# EAGLE design main_board (EAGLE 9.5.1)
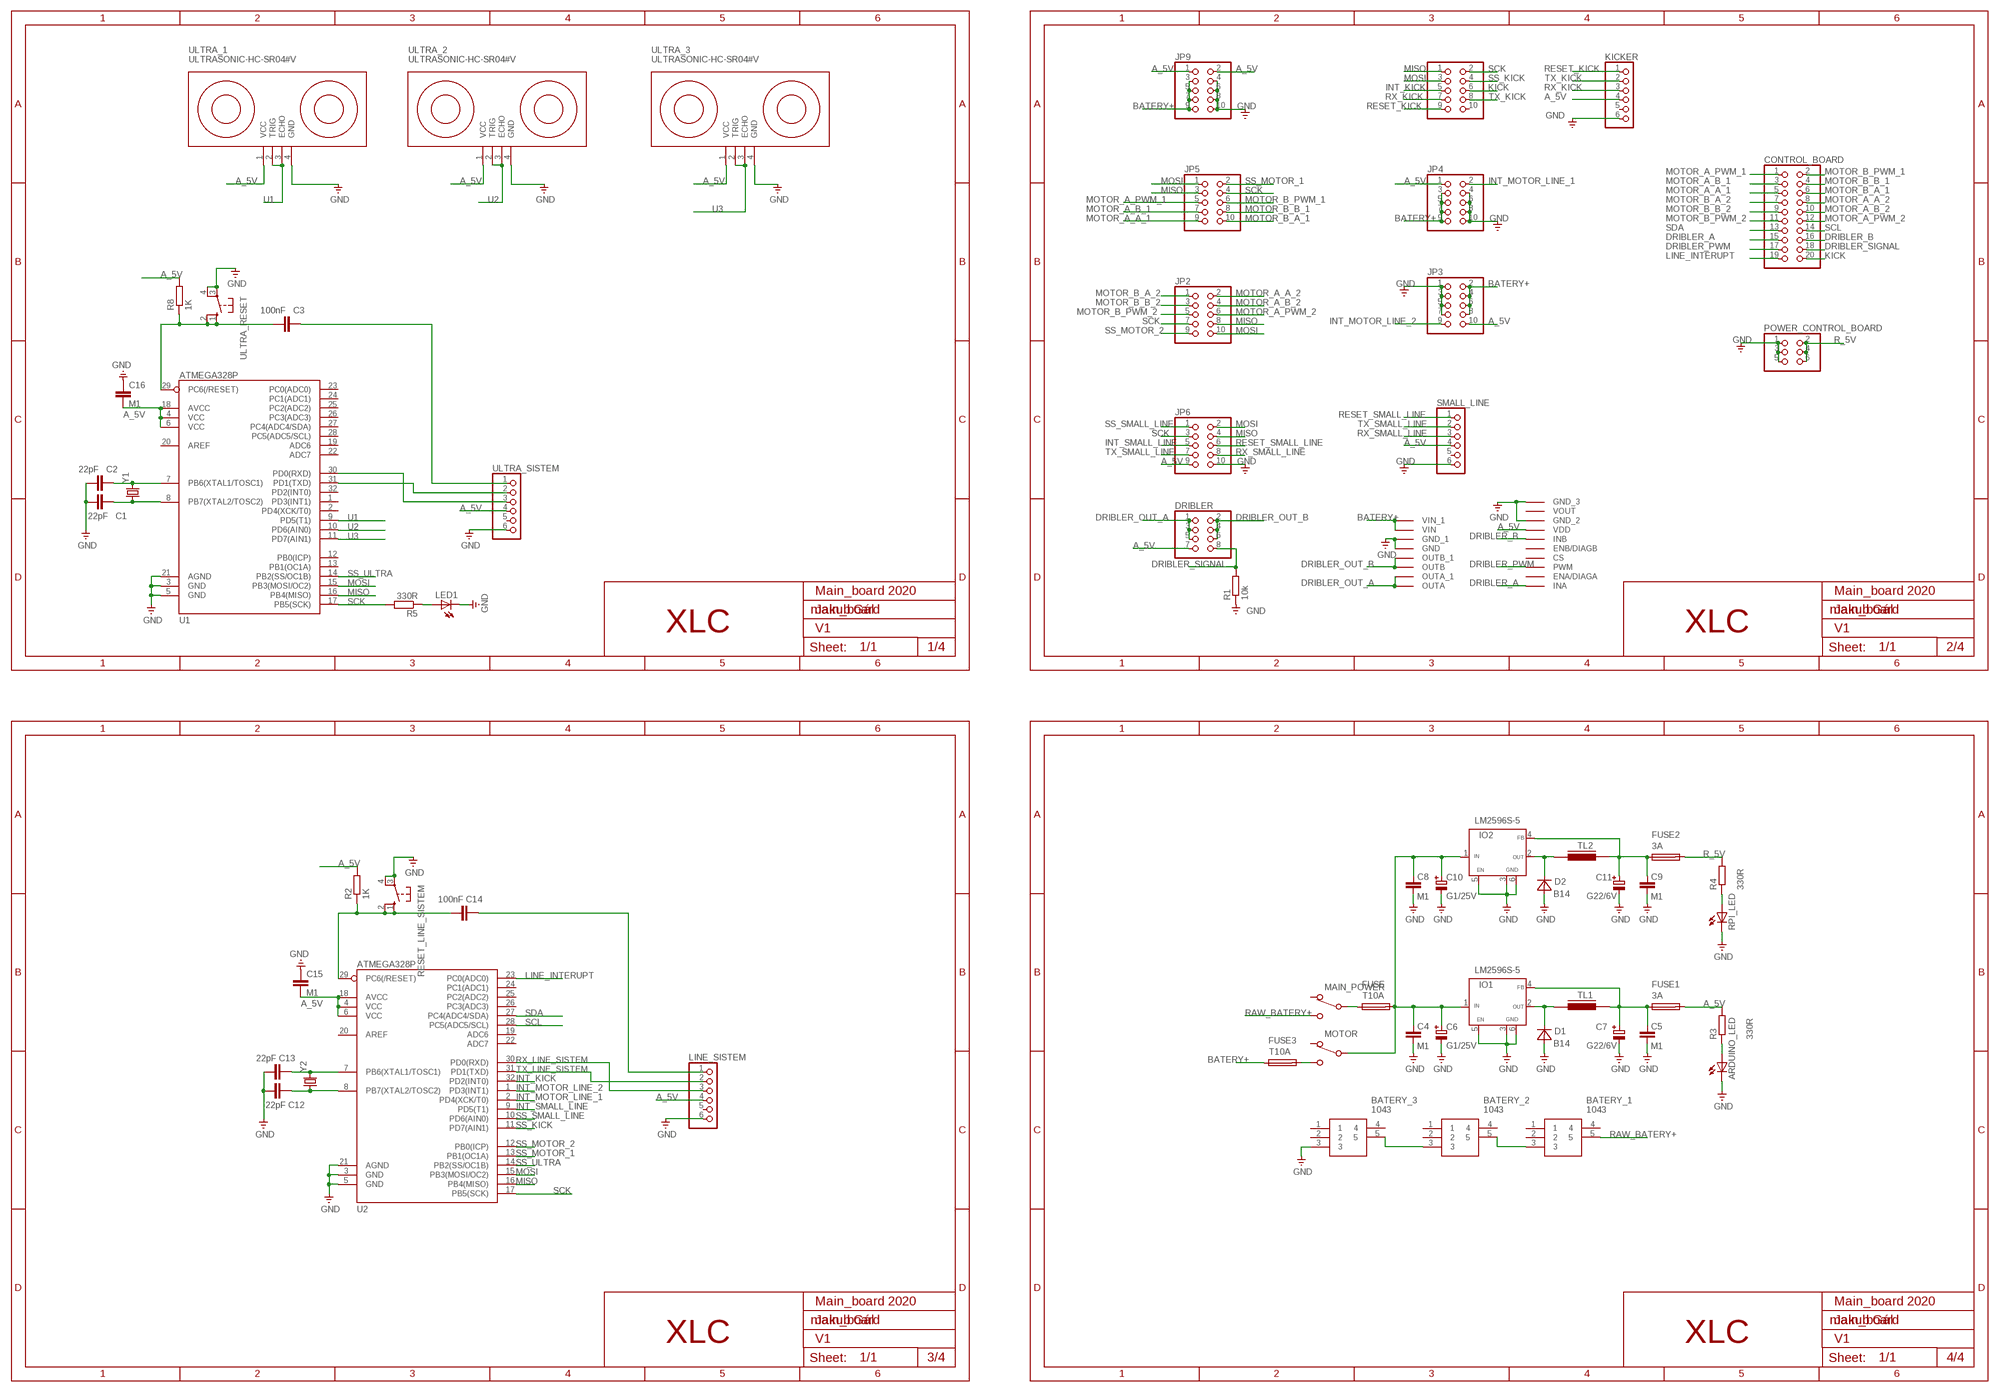
[diagram p0: schematic, sheet 1]

## Parts
ARDUINO_LED  LEDCHIPLED_0603  [CHIPLED_0603]
BATERY_1  1043  [1043]
BATERY_2  1043  [1043]
BATERY_3  1043  [1043]
C1  22pF  C-EUC0603  [C0603]
C2  22pF  C-EUC0603  [C0603]
C3  100nF  C-EUC0603  [C0603]
C4  M1  KOND-KERAM1206-SMD  [SMD-1206]
C5  M1  KOND-KERAM1206-SMD  [SMD-1206]
C6  G1/25V  KOND-ELEKTD-SMD  [SMD-ELE-D]
C7  G22/6V  KOND-ELEKTD-SMD  [SMD-ELE-D]
C8  M1  KOND-KERAM1206-SMD  [SMD-1206]
C9  M1  KOND-KERAM1206-SMD  [SMD-1206]
C10  G1/25V  KOND-ELEKTD-SMD  [SMD-ELE-D]
C11  G22/6V  KOND-ELEKTD-SMD  [SMD-ELE-D]
C12  22pF  C-EUC0603  [C0603]
C13  22pF  C-EUC0603  [C0603]
C14  100nF  C-EUC0603  [C0603]
C15  M1  C-EUC0603  [C0603]
C16  M1  C-EUC0603  [C0603]
CONTROL_BOARD  PINHD-2X10_2.54-SMD  [2X10SMD]
D1  B14  DIODASMD-3,6X5,5  [D-3,6X5,5]
D2  B14  DIODASMD-3,6X5,5  [D-3,6X5,5]
DRIBLER  PINHD-2X4_2.54-SMD  [2X04SMD]
FUSE  T10A  POISTKA2A  [SH22,5A]
FUSE1  3A  POISTKA2A  [SH22,5A]
FUSE2  3A  POISTKA2A  [SH22,5A]
FUSE3  T10A  POISTKA2A  [SH22,5A]
IO1  LM2596S-5  LM2596S  [TO263-5]
IO2  LM2596S-5  LM2596S  [TO263-5]
JP2  PINHD-2X5_2.54-SMD  [2X05SMD]
JP3  PINHD-2X5_2.54-SMD  [2X05SMD]
JP4  PINHD-2X5_2.54-SMD  [2X05SMD]
JP5  PINHD-2X5_2.54-SMD  [2X05SMD]
JP6  PINHD-2X5_2.54-SMD  [2X05SMD]
JP8  PINHD-2X5_2.54-SMD  [2X05SMD]
JP9  PINHD-2X5_2.54-SMD  [2X05SMD]
KICKER  PINHD-1X6  [1X06]
LED1  LEDCHIPLED_0603  [CHIPLED_0603]
LINE_SISTEM  PINHD-1X6  [1X06]
MAIN_POWER  PREP-1PB  [P-B069B]
MOTOR  PREP-1PB  [P-B069B]
POWER_CONTROL_BOARD  PINHD-2X3_2.54-SMD  [2X03SMD]
R1  10k  R-EU_R0603  [R0603]
R2  1K  R-EU_R0603  [R0603]
R3  330R  R-EU_R0603  [R0603]
R4  330R  R-EU_R0603  [R0603]
R5  330R  R-EU_R0603  [R0603]
R8  1K  R-EU_R0603  [R0603]
RESET_LINE_SISTEM  10-XX  [B3F-10XX]
RPI_LED  LEDCHIPLED_0603  [CHIPLED_0603]
SMALL_LINE  PINHD-1X6  [1X06]
TL1  INDUK-TLSMD1  [INDUK-TL]
TL2  INDUK-TLSMD1  [INDUK-TL]
U1  ATMEGA328P  ATMEGA328_SMT  [TQFP32-08]
U2  ATMEGA328P  ATMEGA328_SMT  [TQFP32-08]
U$4  MOTOR_DRIVER  [MOTOR_DRIVER]
ULTRA_1  ULTRASONIC-HC-SR04#V  [ULTRASONIC-HC-SR04#V]
ULTRA_2  ULTRASONIC-HC-SR04#V  [ULTRASONIC-HC-SR04#V]
ULTRA_3  ULTRASONIC-HC-SR04#V  [ULTRASONIC-HC-SR04#V]
ULTRA_RESET  10-XX  [B3F-10XX]
ULTRA_SISTEM  PINHD-1X6  [1X06]
Y1  CRYSTALHC49US  [HC49US]
Y2  CRYSTALHC49US  [HC49US]

## Nets
A_5V: C15.2 C16.2 DRIBLER.7 FUSE1.2 JP3.10 JP4.1 JP6.9 JP9.1 JP9.2 KICKER.4 LINE_SISTEM.4 R2.2 R3.2 R8.2 SMALL_LINE.4 U1.4(VCC) U1.6(VCC) U1.18(AVCC) U2.4(VCC) U2.6(VCC) U2.18(AVCC) U$4.VDD ULTRA_1.1(VCC) ULTRA_2.1(VCC) ULTRA_3.1(VCC) ULTRA_SISTEM.4
BATERY+: FUSE3.1 JP3.2 JP3.4 JP3.6 JP3.8 JP4.3 JP4.5 JP4.7 JP4.9 JP9.3 JP9.5 JP9.7 JP9.9 U$4.VIN U$4.VIN_1
DRIBLER_A: CONTROL_BOARD.15 U$4.INA
DRIBLER_B: CONTROL_BOARD.16 U$4.INB
DRIBLER_OUT_A: DRIBLER.1 DRIBLER.3 DRIBLER.5 U$4.OUTA U$4.OUTA_1
DRIBLER_OUT_B: DRIBLER.2 DRIBLER.4 DRIBLER.6 U$4.OUTB U$4.OUTB_1
DRIBLER_PWM: CONTROL_BOARD.17 U$4.PWM
DRIBLER_SIGNAL: CONTROL_BOARD.18 DRIBLER.8 R1.2
GND: ARDUINO_LED.C BATERY_3.3 C1.1 C2.1 C4.1 C5.1 C6.MINUS C7.MINUS C8.1 C9.1 C10.MINUS C11.MINUS C12.1 C13.1 C15.1 C16.1 D1.A D2.A IO1.3(GND) IO1.5(EN) IO1.6(GND) IO2.3(GND) IO2.5(EN) IO2.6(GND) JP3.1 JP3.3 JP3.5 JP3.7 JP4.4 JP4.6 JP4.8 JP4.10 JP6.10 JP9.4 JP9.6 JP9.8 JP9.10 KICKER.6 LED1.C LINE_SISTEM.6 POWER_CONTROL_BOARD.1 POWER_CONTROL_BOARD.3 POWER_CONTROL_BOARD.5 R1.1 RESET_LINE_SISTEM.3(P) RESET_LINE_SISTEM.4(P1) RPI_LED.C SMALL_LINE.6 U1.3(GND) U1.5(GND) U1.21(AGND) U2.3(GND) U2.5(GND) U2.21(AGND) U$4.GND U$4.GND_1 U$4.GND_2 U$4.GND_3 ULTRA_1.4(GND) ULTRA_2.4(GND) ULTRA_3.4(GND) ULTRA_RESET.3(P) ULTRA_RESET.4(P1) ULTRA_SISTEM.6
INT_KICK: JP8.5 U2.32(PD2(INT0))
INT_MOTOR_LINE_1: JP4.2 U2.2(PD4(XCK/T0))
INT_MOTOR_LINE_2: JP3.9 U2.1(PD3(INT1))
INT_SMALL_LINE: JP6.5 U2.9(PD5(T1))
KICK: CONTROL_BOARD.20 JP8.6
LINE_INTERUPT: CONTROL_BOARD.19 U2.23(PC0(ADC0))
MISO: JP2.8 JP5.3 JP6.4 JP8.1 U1.16(PB4(MISO)) U2.16(PB4(MISO))
MOSI: JP2.10 JP5.1 JP6.2 JP8.3 U1.15(PB3(MOSI/OC2)) U2.15(PB3(MOSI/OC2))
MOTOR_A_A_1: CONTROL_BOARD.5 JP5.9
MOTOR_A_A_2: CONTROL_BOARD.8 JP2.2
MOTOR_A_B_1: CONTROL_BOARD.3 JP5.7
MOTOR_A_B_2: CONTROL_BOARD.10 JP2.4
MOTOR_A_PWM_1: CONTROL_BOARD.1 JP5.5
MOTOR_A_PWM_2: CONTROL_BOARD.12 JP2.6
MOTOR_B_A_1: CONTROL_BOARD.6 JP5.10
MOTOR_B_A_2: CONTROL_BOARD.7 JP2.1
MOTOR_B_B_1: CONTROL_BOARD.4 JP5.8
MOTOR_B_B_2: CONTROL_BOARD.9 JP2.3
MOTOR_B_PWM_1: CONTROL_BOARD.2 JP5.6
MOTOR_B_PWM_2: CONTROL_BOARD.11 JP2.5
N$1: BATERY_1.3 BATERY_2.5
N$2: BATERY_2.3 BATERY_3.5
N$3: D2.K IO2.2(OUT) TL2.1
N$4: FUSE.1 MAIN_POWER.2(2-COM)
N$5: C13.2 U2.7(PB6(XTAL1/TOSC1)) Y2.2
N$6: D1.K IO1.2(OUT) TL1.1
N$7: C2.2 U1.7(PB6(XTAL1/TOSC1)) Y1.2
N$8: C1.2 U1.8(PB7(XTAL2/TOSC2)) Y1.1
N$9: C12.2 U2.8(PB7(XTAL2/TOSC2)) Y2.1
N$11: C5.2 C7.PLUS FUSE1.1 IO1.4(FB) TL1.2
N$12: C14.2 LINE_SISTEM.1
N$13: C14.1 R2.1 RESET_LINE_SISTEM.1(S) RESET_LINE_SISTEM.2(S1) U2.29(PC6(/RESET))
N$14: C4.2 C6.PLUS C8.2 C10.PLUS FUSE.2 IO1.1(IN) IO2.1(IN) MOTOR.2(2-COM)
N$15: FUSE3.2 MOTOR.1(1-OFF)
N$16: U1.30(PD0(RXD)) ULTRA_SISTEM.3
N$17: U1.31(PD1(TXD)) ULTRA_SISTEM.2
N$18: C3.2 ULTRA_SISTEM.1
N$19: C3.1 R8.1 U1.29(PC6(/RESET)) ULTRA_RESET.1(S) ULTRA_RESET.2(S1)
N$20: LED1.A R5.1
N$21: C9.2 C11.PLUS FUSE2.1 IO2.4(FB) TL2.2
N$22: ARDUINO_LED.A R3.1
N$23: R4.1 RPI_LED.A
R_5V: FUSE2.2 POWER_CONTROL_BOARD.2 POWER_CONTROL_BOARD.4 POWER_CONTROL_BOARD.6 R4.2
RAW_BATERY+: BATERY_1.5 MAIN_POWER.1(1-OFF)
RESET_KICK: JP8.9 KICKER.1
RESET_SMALL_LINE: JP6.6 SMALL_LINE.1
RX_KICK: JP8.7 KICKER.3
RX_LINE_SISTEM: LINE_SISTEM.3 U2.30(PD0(RXD))
RX_SMALL_LINE: JP6.8 SMALL_LINE.3
SCK: JP2.7 JP5.4 JP6.3 JP8.2 R5.2 U1.17(PB5(SCK)) U2.17(PB5(SCK))
SCL: CONTROL_BOARD.14 U2.28(PC5(ADC5/SCL))
SDA: CONTROL_BOARD.13 U2.27(PC4(ADC4/SDA))
SS_KICK: JP8.4 U2.11(PD7(AIN1))
SS_MOTOR_1: JP5.2 U2.13(PB1(OC1A))
SS_MOTOR_2: JP2.9 U2.12(PB0(ICP))
SS_SMALL_LINE: JP6.1 U2.10(PD6(AIN0))
SS_ULTRA: U1.14(PB2(SS/OC1B)) U2.14(PB2(SS/OC1B))
TX_KICK: JP8.8 KICKER.2
TX_LINE_SISTEM: LINE_SISTEM.2 U2.31(PD1(TXD))
TX_SMALL_LINE: JP6.7 SMALL_LINE.2
U1: U1.9(PD5(T1)) ULTRA_1.2(TRIG) ULTRA_1.3(ECHO)
U2: U1.10(PD6(AIN0)) ULTRA_2.2(TRIG) ULTRA_2.3(ECHO)
U3: U1.11(PD7(AIN1)) ULTRA_3.2(TRIG) ULTRA_3.3(ECHO)
Unconnected: BATERY_1.1 BATERY_1.2 BATERY_1.4 BATERY_2.1 BATERY_2.2 BATERY_2.4 BATERY_3.1 BATERY_3.2 BATERY_3.4 JP8.10 KICKER.5 LINE_SISTEM.5 MAIN_POWER.3(3-ON) MOTOR.3(3-ON) SMALL_LINE.5 U1.1(PD3(INT1)) U1.2(PD4(XCK/T0)) U1.12(PB0(ICP)) U1.13(PB1(OC1A)) U1.19(ADC6) U1.20(AREF) U1.22(ADC7) U1.23(PC0(ADC0)) U1.24(PC1(ADC1)) U1.25(PC2(ADC2)) U1.26(PC3(ADC3)) U1.27(PC4(ADC4/SDA)) U1.28(PC5(ADC5/SCL)) U1.32(PD2(INT0)) U2.19(ADC6) U2.20(AREF) U2.22(ADC7) U2.24(PC1(ADC1)) U2.25(PC2(ADC2)) U2.26(PC3(ADC3)) U$4.CS U$4.ENA/DIAGA U$4.ENB/DIAGB U$4.VOUT ULTRA_SISTEM.5

## Notes on the sheet
- Main_board 2020 | Main_board 2020
- Jakub Gál | Jakub Gál
- XLC | V1 | XLC | V1
- 1/4 | 2/4
- Main_board 2020 | Main_board 2020
- Jakub Gál | Jakub Gál
- XLC | V1 | XLC | V1
- 3/4 | 4/4

## Library data of the parts
ARDUINO_LED LED1 RPI_LED = audio amplifier example:LED
BATERY_1-BATERY_3 = SamacSys_Parts:1043: KEYSTONE - 1043 - BATTERY HOLDER, 18650, TH Source: Datasheet <https://componentsearchengine.com/Datasheets/1/1043.pdf>; DESCRIPTION: KEYSTONE - 1043 - BATTERY HOLDER, 18650, TH; HEIGHT: mm; MANUFACTURER_NAME: Keystone Electronics; MANUFACTURER_PART_NUMBER: 1043; MOUSER_PART_NUMBER: 534-1043; MOUSER_PRICE-STOCK: https://www.mouser.com/Search/Refine.aspx?Keyword=534-1043
C1-C3 C12-C14 = rcl:C-EU: CAPACITOR, European symbol
C4 C5 C8 C9 = TABOR K1:KOND-KERAM: Kondenzátor keramicky
C6 C7 C10 C11 = TABOR K1:KOND-ELEKT: Kondenzátor elektrolyticky
C15 C16 = rcl:C-EU: CAPACITOR, European symbol; SPICEPREFIX: C
CONTROL_BOARD = pinhead-1:PINHD-2X10: PIN HEADER
D1 D2 = TABOR K1:DIODA: Dioda
DRIBLER = pinhead-1:PINHD-2X4: PIN HEADER
FUSE FUSE1-FUSE3 = TABOR K1:POISTKA2: Drziak sklopistky SH22,5A / vzdialenost vyvodov 22,5 mm /
IO1 IO2 = TABOR K1:LM2596: DC/DC pulzny regulator STEP-DOWN / 3A upraveny podla katalogu
JP2-JP6 JP8 JP9 = pinhead-1:PINHD-2X5: PIN HEADER
KICKER LINE_SISTEM SMALL_LINE ULTRA_SISTEM = pinhead:PINHD-1X6: PIN HEADER
MAIN_POWER MOTOR = TABOR K1:PREP-1P: 1-polovy prepinac
POWER_CONTROL_BOARD = pinhead-1:PINHD-2X3: PIN HEADER
R1-R5 R8 = rcl:R-EU_: RESISTOR, European symbol; SPICEPREFIX: R
RESET_LINE_SISTEM ULTRA_RESET = switch-omron:10-XX: OMRON SWITCH; MPN: B3F-1000; OC_FARNELL: 176432; OC_NEWARK: 36M3542
TL1 TL2 = TABOR K1:INDUK-TL: Tlmivka
U1 U2 = SparkFun-DigitalIC:ATMEGA328_SMT: 32-Pin Atmega328 part Commonly used on Arduino compatible boards Available in QFP and QFN packages TQFP is IC-09069 QFN is non-stock; PROD_ID: IC-09069
U$4 = Moja:MOTOR_DRIVER
ULTRA_1-ULTRA_3 = diy-modules:ULTRASONIC-HC-SR04: Ultrasonic Ranging Module HC-SR04 More details available here: http://randomnerdtutorials.com/complete-guide-for-ultrasonic-sensor-hc-sr04/ Click here to find device on ebay.com <http://www.ebay.com/sch/hc+sr04+ultrasonic>
Y1 Y2 = SparkFun-FreqCtrl:CRYSTAL: Various standard crystals. Proven footprints. Spark Fun Electronics SKU : COM-00534

## Board
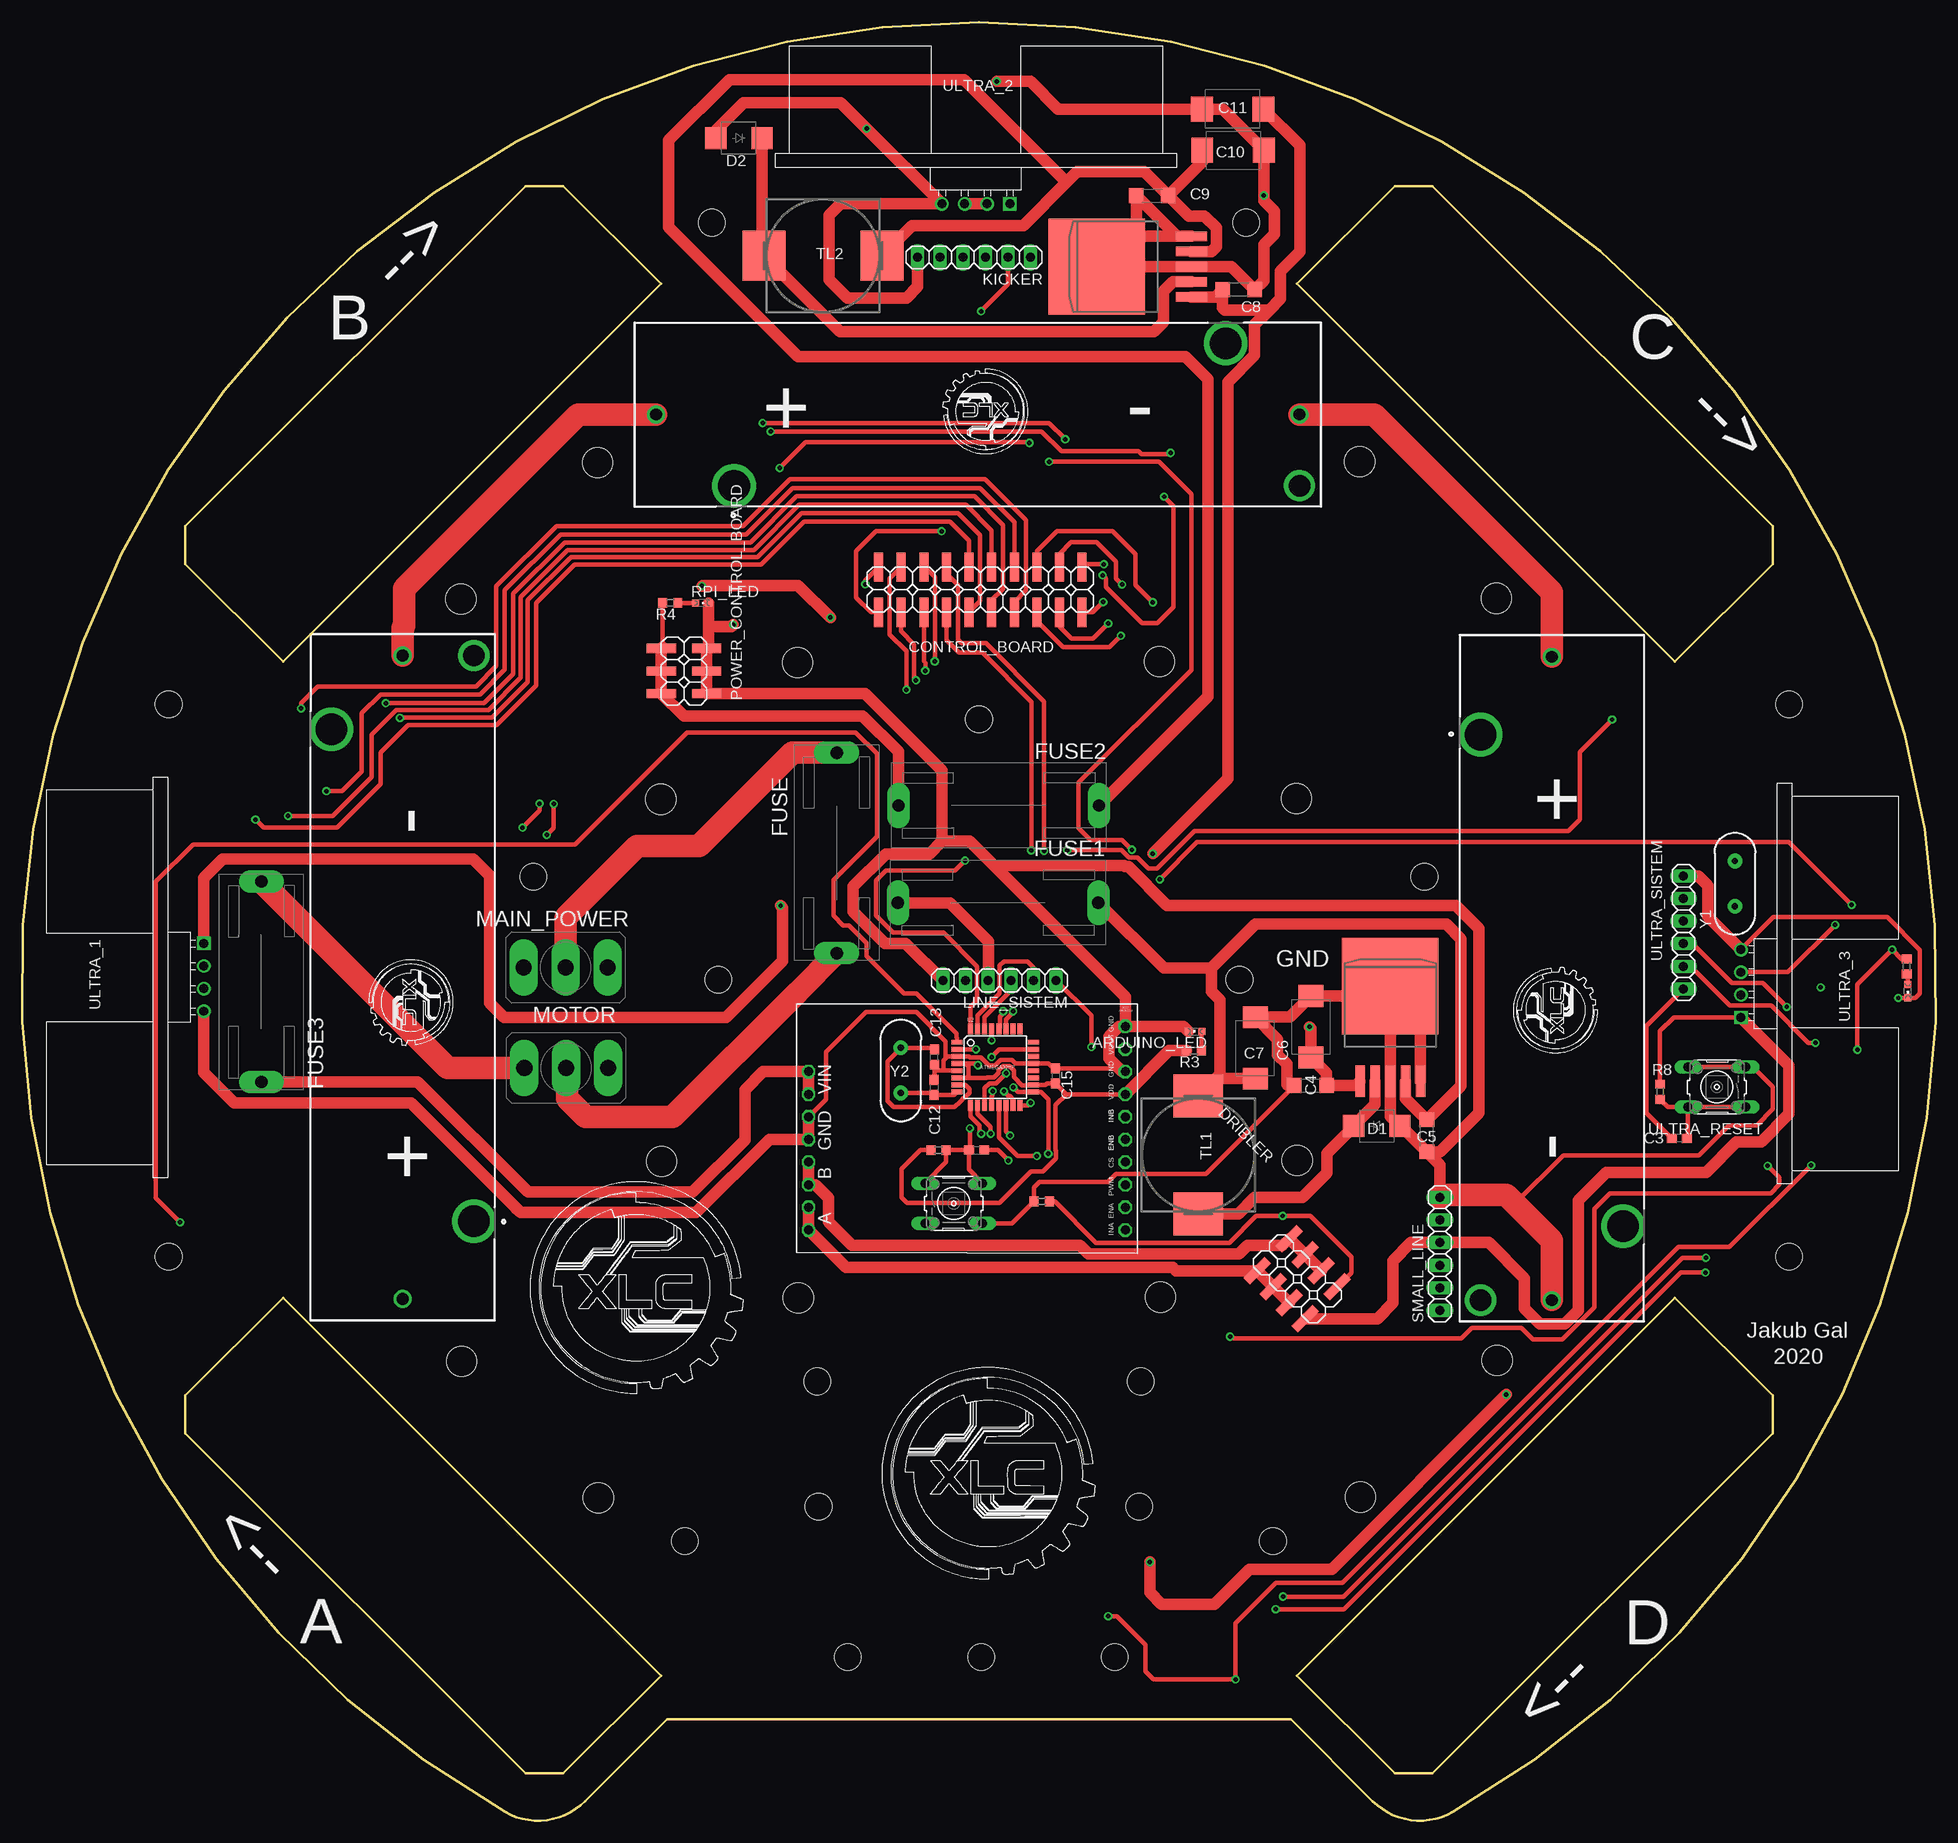
[diagram p1: board, top side]
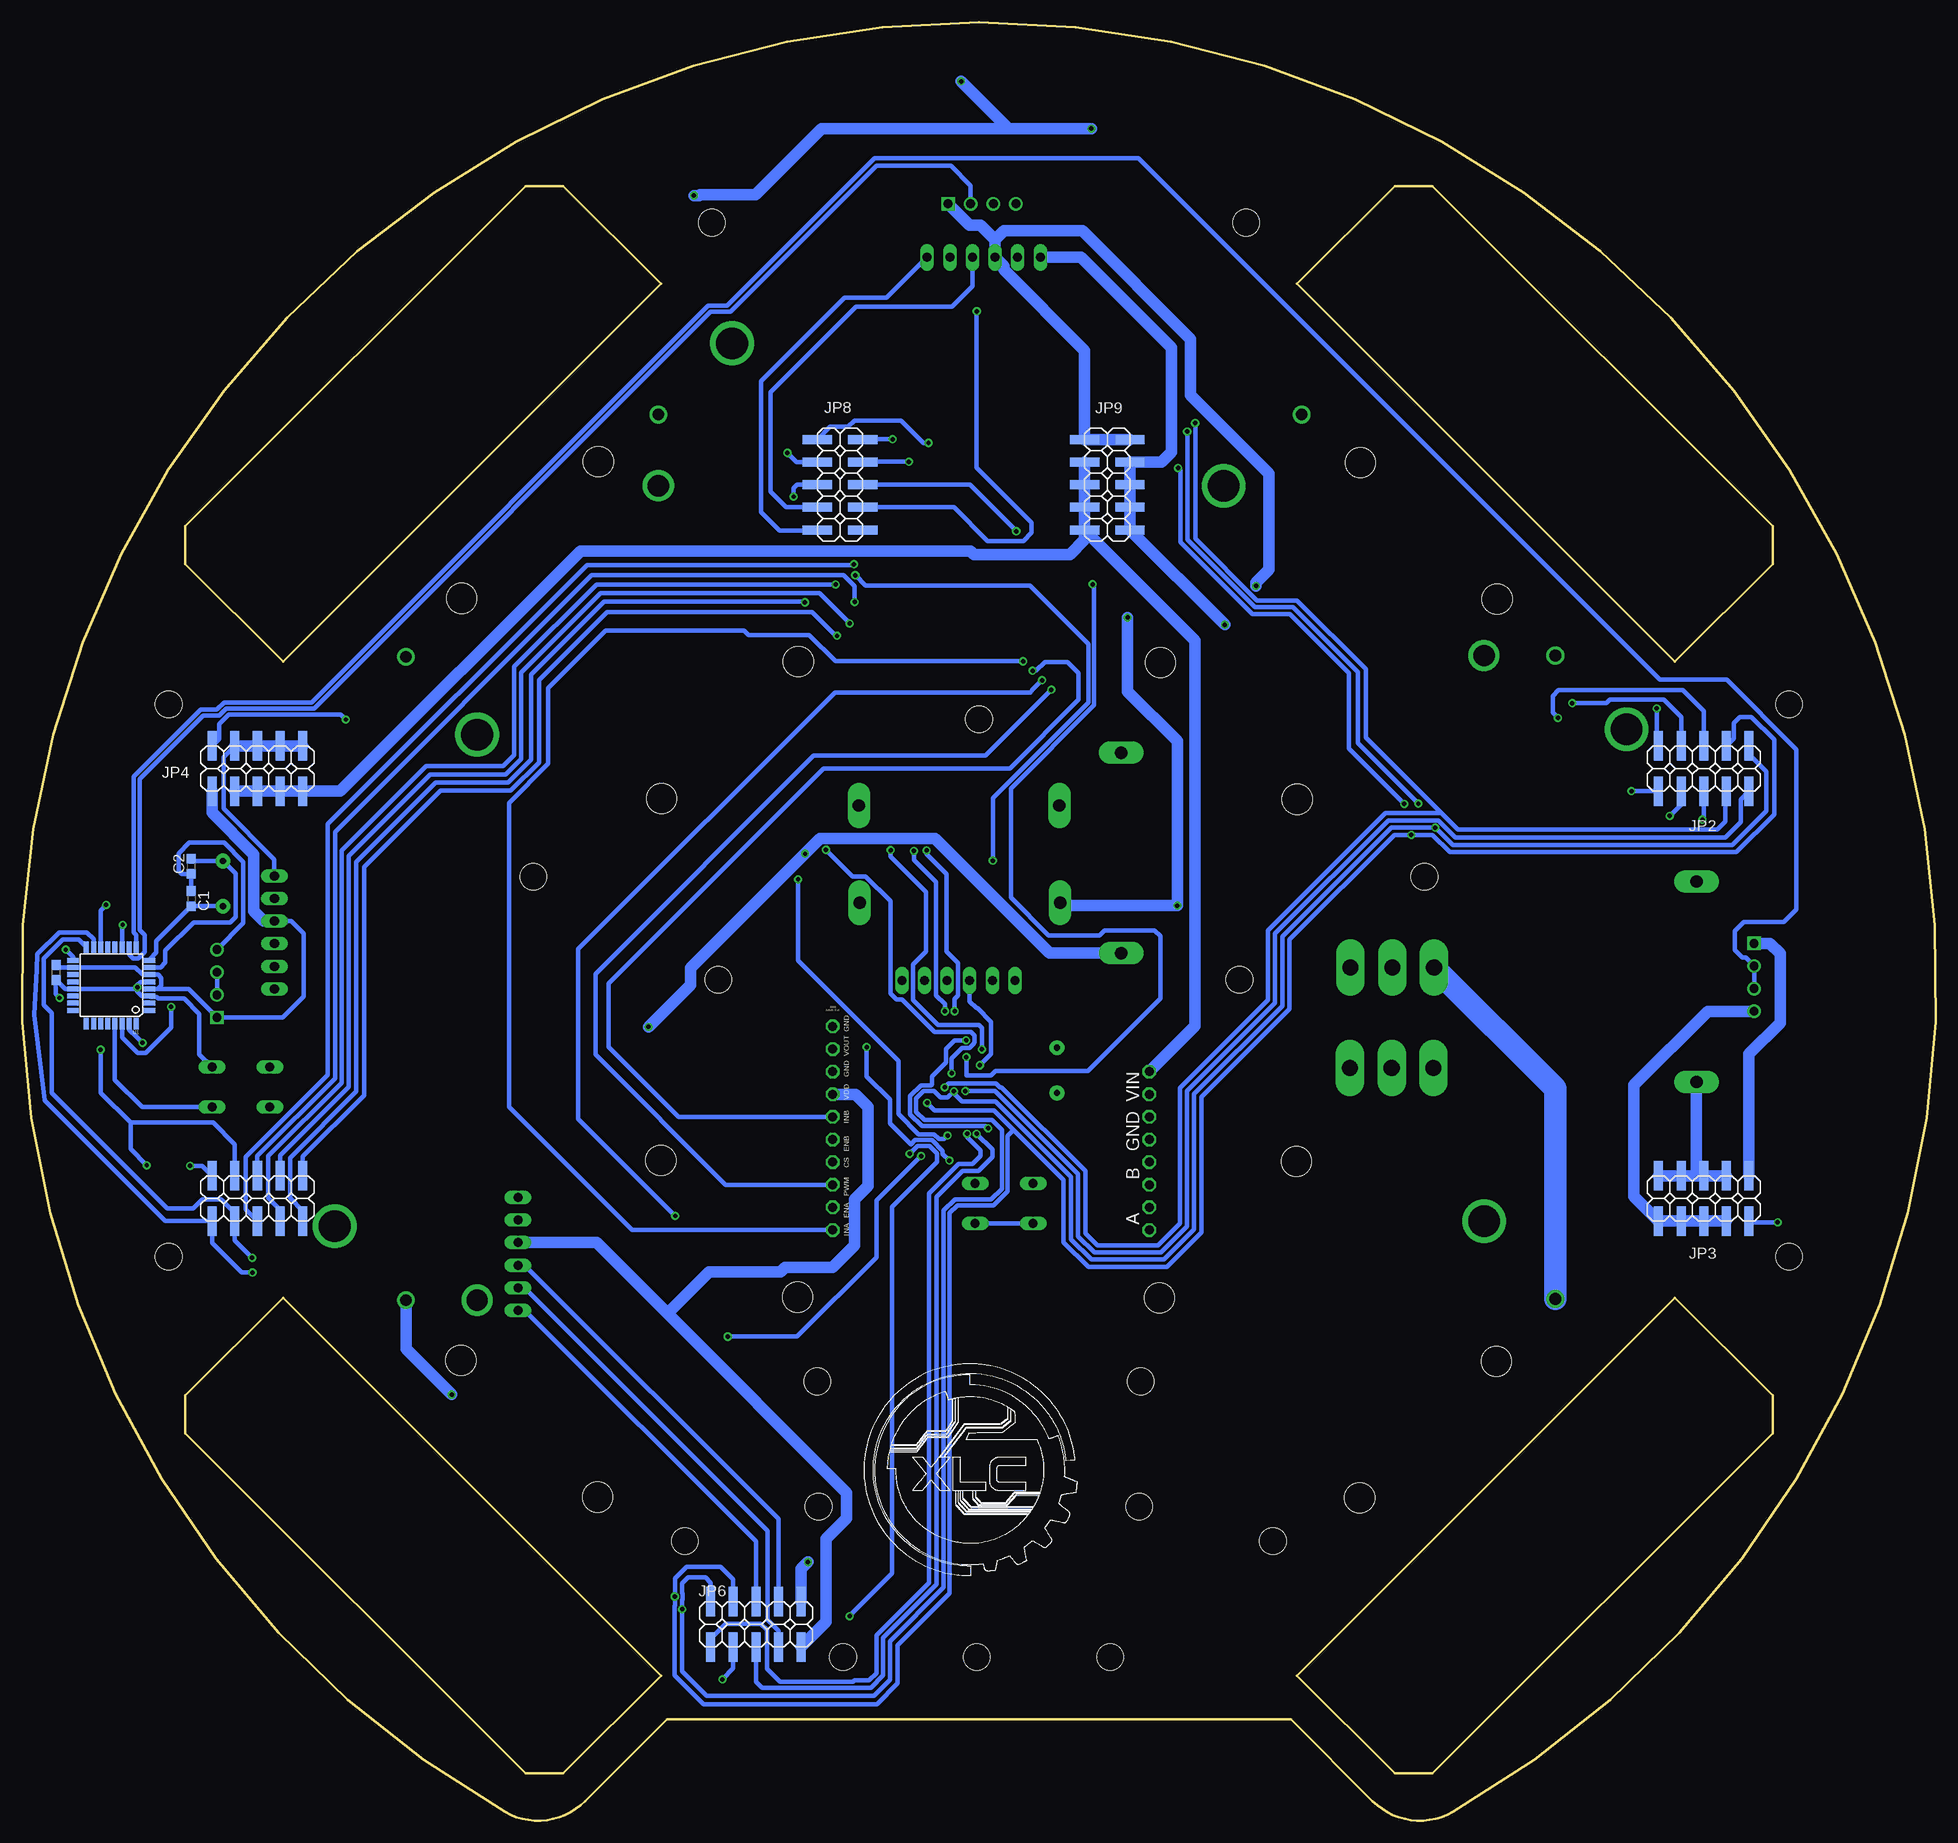
[diagram p2: board, bottom side, seen from below]

Size 214.79 x 201.89 mm. Coordinates in mm from the lower left corner, seen from the top.
Outline: 63.2,2.19 72.4,11.38 142.4,11.38 151.59,2.19 arc75 160.61,0.98 arc301 54.19,0.98 arc75 63.2,2.19
Outline: 196.49,47.72 196.49,43.47 158.31,5.29 154.07,5.29 143.11,16.25 185.53,58.68 196.49,47.72
Outline: 71.69,16.25 60.73,5.29 56.49,5.29 18.3,43.47 18.3,47.72 29.26,58.68 71.69,16.25
Outline: 143.11,172.52 154.07,183.48 158.31,183.48 196.49,145.3 196.49,141.05 185.53,130.09 143.11,172.52
Outline: 29.26,130.09 18.3,141.05 18.3,145.3 56.49,183.48 60.73,183.48 71.69,172.52 29.26,130.09
Copper layers (1*16): Top 0.035mm / dielectric 1.5mm / Bottom 0.035mm
Design rules "default": minimum track width 6mil, minimum drill 0.35mm, track to track 6mil, track to pad 6mil, pad to pad 6mil, via to via 6mil, smd to smd 6mil, copper to edge 40mil, drill to drill 6mil, minimum pad ring 10mil, minimum via ring 8mil, stop-mask expansion 4mil, vias tented up to drill 0mil, thermal gap 10mil
Holes 3 mm at 140.4,31.38 198.35,63.31 78.15,94.38 16.44,63.31 136.64,94.38 125.56,49.3 107.4,123.63 16.44,125.31 77.4,179.38 198.35,125.31 89.4,35.23 57.4,105.94 137.4,179.38 125.4,35.23 89.24,49.3 122.65,18.35 74.4,31.38 157.4,105.94 107.65,18.35 92.65,18.35
Holes 3.4 mm at 143.02,114.76 127.68,130.1 87.03,130.01 64.67,36.22 49.32,51.56 150.13,152.55 150.22,36.31 64.58,152.46 127.77,58.76 71.77,74.01 165.56,51.65 87.12,58.67 143.11,74.1 165.47,137.21 49.23,137.12 71.68,114.67

### Footprints (pad centres in the part's own frame; a part is rotated, then mirrored left to right if it is on the bottom)
CHIPLED_0603 = smd 0.8 x 0.8: A 0,-0.75; C 0,0.75
1043 = drill 3.55 pad 4.9: 1 0,0; 4 55.2,16 | drill 2.39 pad 3.5: 2 63.48,0 | drill 1.32 pad 2: 3 63.48,8; 5 -8.74,8
C0603 = smd 1.1 x 1: 1 -0.85,0; 2 0.85,0
SMD-1206 = smd 1.626 x 1.702: 1 -1.803,0; 2 1.803,0
SMD-ELE-D = smd 2.438 x 2.794: MINUS 3.454,0; PLUS -3.454,0
2X10SMD = smd 1.016 x 3.302: 1 -1.27,-3.81; 2 -1.27,1.27; 3 1.27,-3.81; 4 1.27,1.27; 5 3.81,-3.81; 6 3.81,1.27; 7 6.35,-3.81; 8 6.35,1.27; 9 8.89,-3.81; 10 8.89,1.27; 11 11.43,-3.81; 12 11.43,1.27; 13 13.97,-3.81; 14 13.97,1.27; 15 16.51,-3.81; 16 16.51,1.27; 17 19.05,-3.81; 18 19.05,1.27; 19 21.59,-3.81; 20 21.59,1.27
D-3,6X5,5 = smd 2.388 x 2.489: A 2.591,0; K -2.591,0
2X04SMD = smd 1.016 x 3.302: 1 -1.27,-3.81; 2 -1.27,1.27; 3 1.27,-3.81; 4 1.27,1.27; 5 3.81,-3.81; 6 3.81,1.27; 7 6.35,-3.81; 8 6.35,1.27
SH22,5A = drill 1.397 pad 2.54 long: 1 -11.252,0; 2 11.252,0
TO263-5 = smd 1.067 x 3.505: 1 -3.404,0.762; 2 -1.702,0.762; 3 0,0.762; 4 1.702,0.762; 5 3.404,0.762 | smd 10.82 x 10.82: 6 0,11.43
2X05SMD = smd 1.016 x 3.302: 1 -1.27,-3.81; 2 -1.27,1.27; 3 1.27,-3.81; 4 1.27,1.27; 5 3.81,-3.81; 6 3.81,1.27; 7 6.35,-3.81; 8 6.35,1.27; 9 8.89,-3.81; 10 8.89,1.27
1X06 = drill 1.016 long: 1 -6.35,0; 2 -3.81,0; 3 -1.27,0; 4 1.27,0; 5 3.81,0; 6 6.35,0
P-B069B = drill 1.803 pad 3.175 long: 1 -4.699,0; 2 0,0; 3 4.699,0
2X03SMD = smd 1.016 x 3.302: 1 -1.27,-3.81; 2 -1.27,1.27; 3 1.27,-3.81; 4 1.27,1.27; 5 3.81,-3.81; 6 3.81,1.27
R0603 = smd 1 x 1.1: 1 -0.85,0; 2 0.85,0
B3F-10XX = drill 1.016 long: 1 -3.251,2.261; 2 3.251,2.261; 3 -3.251,-2.261; 4 3.251,-2.261
INDUK-TL = smd 4.826 x 5.588: 1 -6.604,0; 2 6.604,0
TQFP32-08 = smd 1.27 x 0.559: 1 -4.293,2.8; 2 -4.293,2; 3 -4.293,1.2; 4 -4.293,0.4; 5 -4.293,-0.4; 6 -4.293,-1.2; 7 -4.293,-2; 8 -4.293,-2.8; 17 4.293,-2.8; 18 4.293,-2; 19 4.293,-1.2; 20 4.293,-0.4; 21 4.293,0.4; 22 4.293,1.2; 23 4.293,2; 24 4.293,2.8 | smd 0.559 x 1.27: 9 -2.8,-4.293; 10 -2,-4.293; 11 -1.2,-4.293; 12 -0.4,-4.293; 13 0.4,-4.293; 14 1.2,-4.293; 15 2,-4.293; 16 2.8,-4.293; 25 2.8,4.293; 26 2,4.293; 27 1.2,4.293; 28 0.4,4.293; 29 -0.4,4.293; 30 -1.2,4.293; 31 -2,4.293; 32 -2.8,4.293
MOTOR_DRIVER = drill 1 octagon: CS -2.54,-17.78; ENA/DIAGA -7.62,-17.78; ENB/DIAGB 0,-17.78; GND 0,17.78; GND_1 2.54,17.78; GND_2 7.62,-17.78; GND_3 12.7,-17.78; INA -10.16,-17.78; INB 2.54,-17.78; OUTA -10.16,17.78; OUTA_1 -7.62,17.78; OUTB -5.08,17.78; OUTB_1 -2.54,17.78; PWM -5.08,-17.78; VDD 5.08,-17.78; VIN 5.08,17.78; VIN_1 7.62,17.78; VOUT 10.16,-17.78
ULTRASONIC-HC-SR04#V = drill 1 square: 1 -3.81,0 | drill 1: 2 -1.27,0; 3 1.27,0; 4 3.81,0
HC49US = drill 0.7 pad 1.651: 1 -2.54,0; 2 2.54,0

### Placement (x,y rotation side)
ARDUINO_LED  131.68,88.61 90 top
BATERY_1  50.7,67.3 90 top
BATERY_2  79.91,149.85 0 top
BATERY_3  163.73,121.91 270 top
C1  195.83,103.5 270 bottom
C2  195.82,107.13 90 bottom
C3  186.02,76.59 180 top
C4  144.61,82.55 0 top
C5  157.7,76.87 90 top
C6  144.68,89.12 90 top
C7  138.43,86.74 90 top
C8  136.55,171.85 180 top
C9  126.86,182.43 0 top
C10  135.89,192.14 180 top
C11  135.93,187.52 0 top
C12  102.35,82.31 270 top
C13  102.39,85.71 90 top
C14  107.14,75.28 0 top
C15  116.01,83.59 270 top
C16  210.98,95.2 90 bottom
CONTROL_BOARD  117.72,136.91 180 top
D1  152.05,77.99 0 top
D2  80.46,188.87 180 top
DRIBLER  142.23,63.53 315 top
FUSE  91.41,108.63 270 top
FUSE1  109.55,103.04 180 top
FUSE2  109.62,113.95 180 top
FUSE3  26.84,94.17 90 top
IO1  153.58,82.24 0 top
IO2  132.03,174.45 90 top
JP2  29.84,119.37 0 bottom
JP3  29.84,71.11 0 bottom
JP4  192.21,119.37 0 bottom
JP5  192.21,71.11 0 bottom
JP6  136.25,23.31 0 bottom
JP8  121.72,153.78 270 bottom
JP9  91.72,153.78 270 bottom
KICKER  106.86,175.51 180 top
LED1  211.69,93.12 180 top
LINE_SISTEM  109.71,94.32 180 top
MAIN_POWER  61,95.78 0 top
MOTOR  61.06,84.5 0 top
POWER_CONTROL_BOARD  73.01,127.79 90 top
R1  114.45,69.51 0 top
R2  102.86,75.27 180 top
R3  131.54,86.43 180 top
R4  72.74,136.7 180 top
R5  211.55,95.89 90 top
R8  183.86,81.82 90 top
RESET_LINE_SISTEM  104.57,69.29 0 top
RPI_LED  76.32,136.69 270 top
SMALL_LINE  159.14,63.62 90 top
TL1  132.01,74.73 90 top
TL2  89.9,175.67 0 top
U1  204.8,93.76 180 bottom
U2  109.23,84.58 0 top
U$4  106.05,76.46 90 top
ULTRA_1  20.38,94.67 270 top
ULTRA_2  107.05,181.5 180 top
ULTRA_3  192.94,93.97 90 top
ULTRA_RESET  190.25,82.35 180 top
ULTRA_SISTEM  186.49,99.71 90 top
Y1  192.27,105.19 90 top
Y2  98.63,84.22 90 top

### Tracks (layer width: path | path; a pad name or v marks a point on that pad's centre or on a via)
A_5V  (via drill 0.5)
  Top 0.508: R8.2 183.86,88.64 185.39,90.16 ULTRA_3.1 | 117.21,81.54 U$4.VDD | 117.21,81.54 C15.2 115.03,82.74 114.89,82.59 U2.18 113.49,82.55 112.26,82.55 111.32,83.49 111.32,84.24 110.81,84.74 110.1,84.74 109.6,84.24 109.6,83.96 109.06,83.42 108.3,83.42 108.26,83.38 106,83.38 | U2.6 106,83.38 | 105.92,84.98 106.24,84.66 106.24,83.62 106,83.38 | U2.4 105.92,84.98 | R2.2 100.83,75.27 98.71,73.14 98.71,69.96 99.33,69.34 101.39,69.34 109.69,69.34 113.22,72.87 114.6,72.87 116.04,74.31 116.04,75.21 116.02,75.23 116.02,80.35 117.21,81.54 | 105.92,84.98 107.11,84.98 v107.29,84.8
  Top 1.27: FUSE1.2 104.15,103.04 108.49,98.69 108.49,94.37 LINE_SISTEM.4 | U$4.VDD 128.72,86.43 R3.2 | DRIBLER.7 152.11,56.34 153.86,58.1 153.86,62.85 155.9,64.89 SMALL_LINE.4 164.62,64.89 168.64,60.87 168.64,57.49 170.39,55.74 173.16,55.74 174.69,57.27 174.69,69.6 177.85,72.76 189.03,72.76 192.45,76.18 195.22,76.18 198.34,79.3 198.34,84.76 ULTRA_3.1 | ULTRA_1.1 20.38,105.84 22.48,107.93 50.62,107.93 52.45,106.1 52.45,91.76 54.07,90.14 79.04,90.14 85.38,96.48 85.38,102.47 v85.13,102.72 | v90.72,135.06 87.12,138.66 76.36,138.66 v76.3,138.6
  Bottom 0.508: U1.4 199.6,93.36 | 199.6,93.36 199.19,93.77 199.19,94.61 199.55,94.96 U1.6 201.29,94.96 202.11,95.78 209.07,95.78 U1.18 210.69,95.76 C16.2 | 199.6,93.36 196.14,93.36 ULTRA_3.1 185.56,90.16 183.22,92.5 183.22,99.57 184.63,100.98 ULTRA_SISTEM.4 | v107.29,84.8 106.04,86.05 106.04,89.67 107.58,91.21 107.67,91.21 108.44,91.98 LINE_SISTEM.4
  Bottom 1.27: ULTRA_2.1 108.47,179.11 107.22,179.11 105.59,177.48 | 105.59,177.48 KICKER.4 104.6,174.51 104.6,174.1 95.53,165.03 JP9.1 JP9.2 | JP3.10 20.95,86.07 17.46,89.55 17.46,97.35 18.59,98.48 ULTRA_1.1 | JP4.1 193.48,115.34 193.49,115.33 193.49,113.15 188.8,108.46 188.8,102.1 187.68,100.98 ULTRA_SISTEM.4 | JP6.9 124.54,22.32 124.54,31.63 122.25,33.93 122.25,36.82 142.35,56.92 | SMALL_LINE.4 150.32,64.89 142.35,56.92 | U$4.VDD 121.26,81.54 119.85,80.12 119.85,71.26 121.37,69.74 121.37,64.59 123.85,62.11 129.16,62.11 129.66,61.6 137.68,61.6 142.35,56.92 | FUSE1.2 97.98,102.72 v85.13,102.72 85.13,121.18 90.72,126.77 v90.72,135.06 | v76.3,138.6 76.3,138.97 74.83,140.44 74.83,151.22 83.64,160.03 83.64,166.33 95.77,178.46 104.6,178.46 105.59,177.48
BATERY+
  Top 1.27: FUSE3.1 44.41,82.92 56.76,70.57 75.26,70.57 81.12,76.42 81.12,82.02 83.18,84.08 U$4.VIN_1 U$4.VIN
  Bottom 1.27: JP3.2 JP3.4 JP3.6 | JP3.8 JP3.6 | FUSE3.1 26.84,73.2 JP3.6 | JP9.9 JP9.7 JP9.5 JP9.3 | JP4.3 JP4.5 JP4.7 JP4.9 179.11,115.56 152.14,142.53 108.35,142.53 107.93,142.11 97.2,142.11 95.53,143.79 JP9.9 | U$4.VIN_1 83.13,89.22 83.13,132.5 JP9.9
DRIBLER_A  (via drill 0.5)
  Top 0.508: CONTROL_BOARD.15 101.3,140.72 102.45,139.57 v102.45,130.14 v102.43,130.14
  Bottom 0.508: v102.43,130.14 123.52,130.14 126.45,133.07 133.24,133.07 133.76,133.58 149.32,133.58 155.75,127.15 155.75,118.66 160.17,114.24 160.17,80.11 146.35,66.3 U$4.INA
DRIBLER_B  (via drill 0.5)
  Top 0.508: CONTROL_BOARD.16 101.21,130.14 101.38,129.97 v101.38,129.08
  Bottom 0.508: v101.38,129.08 101.01,129.08 100.01,130.08 97.48,130.08 96.24,128.84 96.24,125.83 103.94,118.13 124.82,118.13 148.97,93.98 148.97,86.84 141.12,79 U$4.INB
DRIBLER_OUT_A
  Top 1.27: U$4.OUTA_1 U$4.OUTA 92.46,62.11 129.16,62.11 129.53,61.73 DRIBLER.1 DRIBLER.3 DRIBLER.5 | DRIBLER.5
DRIBLER_OUT_B
  Top 1.27: U$4.OUTB_1 U$4.OUTB 89.05,71.38 90.53,69.91 90.53,67.2 93.14,64.58 118.75,64.58 119.7,63.63 136.61,63.63 137.56,64.58 141.49,64.58 DRIBLER.2 DRIBLER.4 DRIBLER.6 | DRIBLER.6
DRIBLER_PWM  (via drill 0.5)
  Top 0.508: CONTROL_BOARD.17 97.36,139.41 97.36,133.16 99.25,131.27 99.25,131.05 99.25,126.98 v99.26,126.97
  Bottom 0.508: v99.26,126.97 106.68,119.54 125.96,119.54 150.45,95.05 150.45,86.01 135.81,71.38 U$4.PWM
DRIBLER_SIGNAL  (via drill 0.5)
  Top 0.508: CONTROL_BOARD.18 98.67,133.51 100.14,132.04 100.14,128.21 v100.32,128.03 | R1.2 115.91,69.51 120.54,64.87 135.51,64.87 138.52,67.88 v141.5,67.88 144.6,67.88 149.19,63.29 149.19,61.51 DRIBLER.8
  Bottom 0.508: v100.32,128.03 101.42,126.93 101.42,126.86 101.62,126.66 123.57,126.66 152.39,97.84 152.39,78.77 v141.5,67.88
GND  (via drill 0.5)
  Top 0.508: C5.1 157.57,75.07 | 156.8,91.26 156.98,91.08 156.16,91.08 IO1.6 154.45,92.79 | v210.6,92.35 211.66,92.35 LED1.C 212.53,92.37 213.03,92.87 213.03,97.73 209.35,101.41 196.57,101.41 ULTRA_3.4 | ULTRA_RESET.4 ULTRA_RESET.3 194.27,84.61 196.53,82.35 196.53,79.89 194.7,78.06 191.57,78.06 188.19,74.68 172.98,74.68 167.57,69.28 | RESET_LINE_SISTEM.4 111.12,67.03 R1.1 113.6,71.11 114.19,71.69 121.88,71.69 122.81,72.62 132.89,72.62 C4.1 | C13.1 102.39,84.2 | 102.39,84.2 102.39,83.2 C12.1 | 102.39,84.2 103.56,84.2 | 103.56,84.2 104.92,84.2 U2.5 | 103.67,85.57 103.88,85.78 U2.3 106.27,85.78 106.39,85.66 107.64,85.66 108.52,84.78 109.21,84.78 109.83,85.4 111.09,85.4 111.51,84.98 U2.21 115.23,84.99 115.78,84.44 C15.1 123.47,84.44 U$4.GND_2 | 103.67,85.57 103.44,85.34 103.44,84.32 103.56,84.2 | U$4.GND_1 90.24,80.97 90.24,86.31 94.7,90.77 100.37,90.77 103.67,87.47 103.67,85.57 | 121.96,175.81 IO2.6 124.54,174.45 125.38,173.61 | IO2.5 124.86,177.85 124.85,177.86
  Top 1.27: IO1.5 156.98,90.26 154.45,92.79 | C4.1 142.09,82.55 141.97,82.66 141.97,84.94 140.93,85.98 140.93,87.7 C7.MINUS 142.3,90.2 C6.MINUS 152.48,92.57 IO1.6 IO1.3 153.58,79.06 D1.A 154.77,77.99 C5.1 | C5.1 159.14,73.63 SMALL_LINE.6 | 125.38,173.61 124.55,174.43 124.57,174.45 IO2.3 135.76,174.45 C8.1 139.38,172.89 139.38,176.91 140.55,178.08 140.55,180.69 139.38,181.86 v139.38,182.44 C11.MINUS | IO2.5 131.25,177.86 129.63,177.86 | C11.MINUS 139.38,186.53 | C11.MINUS 134.76,192.14 C10.MINUS 116.27,192.14 113.16,195.25 v109.4,195.25 | D2.A 77.87,189.75 80.98,192.86 91.88,192.86 v94.79,189.95 ULTRA_2.4 91.87,181.5 90.57,180.21 90.57,172.98 92.64,170.92 99.24,170.92 100.51,172.19 KICKER.6 | U$4.GND_2 123.46,84.08 121.99,85.55 121.99,88.05 123.1,89.16 U$4.GND_3 | U$4.GND_3 130.38,89.16 ARDUINO_LED.C 130.76,88.78 | LINE_SISTEM.6 99.18,98.49 96.83,98.49 93.29,102.03 93.29,104.85 96.97,108.53 101.85,108.53 103.26,109.94 | 103.26,109.94 103.26,117.89 94.63,126.52 POWER_CONTROL_BOARD.1 POWER_CONTROL_BOARD.3 POWER_CONTROL_BOARD.5 77.07,131.85 77.07,133.86 | U$4.GND_3 123.83,92.47 109.1,107.2 | 103.26,109.94 106.36,109.94 109.1,107.2 | C5.1 159.14,75.07 163.52,79.45 163.52,100.15 160.92,102.76 128.48,102.76 124.16,107.08 123.79,107.08 123.67,107.2 109.1,107.2 | ULTRA_3.4 189.25,101.47 189.25,104.97 188.15,106.06 ULTRA_SISTEM.6 | U$4.GND_1 U$4.GND 83.87,76.46 75.67,68.26 55.95,68.26 55.54,68.67 | 55.54,68.67 55.44,68.67 | ULTRA_1.4 20.38,83.98 23.8,80.57 43.64,80.57 55.54,68.67 | v166.59,47.82 147,28.23 137.79,28.23 133.86,24.3 127.91,24.3 126.59,25.62 v126.59,29.02
  Top 1.27: 121.96,175.81 124.01,177.86 124.85,177.86 129.63,177.86 | IO2.6 125.06,178.91 C9.1 129.63,177.86 | RPI_LED.C 77.07,133.86 | 77.07,133.86 77.26,134.05 79.61,134.05 v79.8,134.25
  Top 2.54: SMALL_LINE.6 159.43,70.26 166.59,70.26 167.57,69.28 171.73,65.13 BATERY_3.3
  Bottom 0.508: v201.88,93.55 201.88,93.07 201.38,92.56 U1.3 200.39,92.45 199.7,92.45 199.54,92.29 196.62,92.29 194.91,90.57 194.91,86.03 ULTRA_RESET.3 | v201.88,93.55 201.88,93.8 201.52,94.16 U1.5 | v210.6,92.35 211.02,92.77 211.02,94.31 C16.1 209.99,93.36 U1.21 202.06,93.36 v201.88,93.55 | ULTRA_SISTEM.6 186.49,107.91 192.19,113.61 192.19,119.39 JP4.4 | C1.1 195.83,106.27 | 195.83,106.27 C2.1 | ULTRA_3.4 189.97,100.75 189.97,107.63 192.13,109.79 196.03,109.79 197.26,108.56 197.26,106.65 196.88,106.27 195.83,106.27 | RESET_LINE_SISTEM.3 RESET_LINE_SISTEM.4
  Bottom 1.27: JP9.4 JP9.6 JP9.8 JP9.10 | JP3.7 JP3.5 JP3.3 JP3.1 33.85,70.05 33.85,82.6 25.59,90.86 ULTRA_1.4 | JP4.10 JP4.8 JP4.6 JP4.4 | v166.59,47.82 171.73,52.96 BATERY_3.3 | v126.59,29.02 127.36,28.25 JP6.10 | v109.4,195.25 104.1,189.95 v94.79,189.95 125.05,189.95 132.46,182.54 138.7,182.54 138.79,182.44 v139.38,182.44 | KICKER.6 95.95,175.51 85.81,165.36 85.81,153.62 86.92,152.51 JP9.4 | v79.8,134.25 JP9.10 | JP9.10 JP9.4
INT_KICK  (via drill 0.5)
  Top 0.508: U2.32 106.43,91.32 107.19,92.07 107.19,95.89 103.41,99.67 97.78,99.67 95.84,101.61 95.84,105.52 96.96,106.64 104.73,106.64 v105.85,107.76 | v121.28,139.8 121.66,139.42 121.66,138.47 125.7,134.43 127.45,134.43 129.24,136.22 129.24,147.58 v128.19,148.63
  Bottom 0.508: v105.85,107.76 105.85,114.79 95.13,125.51 95.13,132.1 101.66,138.63 120.11,138.63 v121.28,139.8 | v128.19,148.63 128.19,149.59 127.81,149.97 JP8.5
INT_MOTOR_LINE_1  (via drill 0.5)
  Top 0.508: v178.48,123.6 174.86,119.98 174.86,112.36 173.57,111.07 131.58,111.07 127.38,106.87 126.42,106.87 125.17,108.12 124.22,108.12 123.4,108.94 v117.31,108.94 | v107.06,86.57 104.95,86.57 U2.2
  Bottom 0.508: JP4.2 192.71,121.41 192.71,123.08 191.61,124.18 179.06,124.18 v178.48,123.6 | v117.31,108.94 117.31,108.2 113.34,104.23 113.34,97.58 114.8,96.12 114.8,92.1 111.99,89.29 107.39,89.29 107.06,88.96 v107.06,86.57
INT_MOTOR_LINE_2  (via drill 0.5)
  Top 0.508: v17.73,67.17 15,69.9 15,105.4 19.2,109.6 62.07,109.6 74.64,122.17 93.56,122.17 95.94,119.79 95.94,110.46 91.08,105.6 91.08,101.59 92.17,100.5 92.82,100.5 94.78,98.54 94.78,97.08 99,92.86 100.4,92.86 104.88,88.39 104.88,87.93 104.94,87.86 U2.1
  Bottom 0.508: v17.73,67.17 20.82,67.17 JP3.9
INT_SMALL_LINE  (via drill 0.5)
  Top 0.508: v107.66,77.09 107.47,77.28 107.47,78.01 106.43,79.05 U2.9
  Bottom 0.508: JP6.5 132.44,15.59 131.77,14.92 119.53,14.92 118.16,16.29 118.16,20.49 112.14,26.51 112.14,69.29 112.15,69.3 112.15,70.01 109.24,72.92 107.47,72.92 105.89,74.5 105.89,75.32 v107.66,77.09
KICK  (via drill 0.5)
  Top 0.508: v103.21,144.75 95.84,144.75 93.62,142.53 93.62,137.28 95.26,135.64 CONTROL_BOARD.20
  Bottom 0.508: JP8.6 108.43,149.97 v103.21,144.75
LINE_INTERUPT  (via drill 0.5)
  Top 0.508: CONTROL_BOARD.19 94.64,139.23 v94.64,138.8 | v108.82,85.72 109.68,86.58 U2.23
  Bottom 0.508: v108.82,85.72 108.82,85.48 108.8,85.46 108.8,83.68 108.77,83.65 106.07,83.65 105.54,84.18 95.16,84.18 87.03,92.31 87.03,99.29 87.67,99.93 93.33,99.93 93.88,99.38 99.59,99.38 103.82,103.61 103.82,115.89 94.47,125.24 94.47,138.63 v94.64,138.8
MISO  (via drill 0.5)
  Top 0.508: v113.21,80.57 112.92,80.29 U2.16 | v189.01,63.18 186.36,63.18 148.31,25.14 141.55,25.14 v141.54,25.15 | v58.87,110.66 59.66,111.45 v59.66,114.14 | v85.04,151.84 87.94,154.74 112.98,154.74 v113.06,154.66
  Bottom 0.508: 212.4,95.46 212.4,91.59 211.49,90.67 211.49,81.68 198.53,68.73 195.58,68.73 194.57,69.74 192.48,69.74 190.94,68.19 JP5.3 190.94,65.11 v189.01,63.18 | 212.4,95.46 212.36,95.5 | 212.4,95.46 212.4,96.78 210.27,98.91 208.45,98.91 U1.16 | JP2.8 22.68,121.45 22.68,123.2 22,123.88 20.67,123.88 18.13,121.34 18.13,112.95 22.37,108.71 30.04,108.71 54.54,108.71 56.5,110.66 v58.87,110.66 60.76,110.66 72.53,98.89 72.53,91.12 82.43,81.22 82.43,66.02 86.29,62.16 95.12,62.16 97.89,64.93 97.89,71.92 103.52,77.54 | v113.21,80.57 112.37,79.73 105.71,79.73 105.13,79.15 103.52,77.54 | 103.52,77.54 104.18,76.88 104.18,70.65 105.76,69.06 109.83,69.06 110.69,68.2 110.69,25.51 116.52,19.68 116.52,15.42 118.85,13.08 138.33,13.08 141.57,16.32 141.57,24.09 141.54,24.12 v141.54,25.15 141.54,27.18 140.2,28.51 136.42,28.51 134.98,27.07 JP6.4 | v59.66,114.14 65.85,120.33 65.85,128.8 72.47,135.42 76.71,135.42 84.8,143.51 84.8,151.6 v85.04,151.84 | v113.06,154.66 113.63,154.66 116.15,157.18 121.39,157.18 122.08,156.49 124.09,156.49 JP8.1
MOSI  (via drill 0.5)
  Top 0.508: v110.21,81.86 110.74,81.33 110.88,81.33 111.23,80.98 U2.15 | v188.96,61.52 186.19,61.52 148.4,23.73 v140.71,23.73 | v56.16,111.47 58.07,113.38 v58.07,114.17 | v84.02,155.94 114.45,155.94 116.68,153.71 125.32,153.71 125.64,153.39 128.76,153.39 v128.91,153.54
  Bottom 0.508: 213.18,95.55 213.43,90.42 212.25,80.85 198.73,67.33 198.45,67.33 198.42,67.3 JP5.1 193.48,64.84 190.16,61.52 v188.96,61.52 | 213.18,95.55 | 213.18,95.55 213.1,97.28 210.67,99.72 207.56,99.72 206.8,98.95 U1.15 | JP2.10 20.95,119.71 19.02,117.78 19.02,113.34 22.84,109.52 54.21,109.52 v56.16,111.47 61.09,111.47 73.34,99.23 73.34,91.46 83.24,81.56 83.24,66.36 86.62,62.97 94.79,62.97 97.08,65.26 97.08,72.25 105.55,80.72 109.28,80.72 110.21,81.65 v110.21,81.86 110.9,81.17 111.72,81.17 112.44,81.89 113.62,81.89 114.45,81.06 114.45,79.56 113.52,78.63 105.92,78.63 104.84,77.55 104.84,70.92 106.04,69.72 110.1,69.72 111.35,68.48 111.35,26.16 117.38,20.13 117.38,15.83 119.19,14.02 137.96,14.02 140.71,16.77 v140.71,23.73 140.71,24.77 140.68,24.8 140.68,25.51 140.71,25.54 140.71,26.65 140.07,27.29 138.1,27.29 137.52,26.71 JP6.2 | v58.07,114.17 64.86,120.96 64.86,128.96 72.15,136.25 76.44,136.25 84.02,143.83 v84.02,155.94 | v128.91,153.54 127.88,152.51 JP8.3
MOTOR_A_A_1  (via drill 0.5)
  Top 0.508: v126.93,136.76 124.97,138.72 124.97,142.18 122.39,144.76 120.75,144.76 116.16,144.76 113.91,142.51 CONTROL_BOARD.5
  Bottom 0.508: JP5.9 183.32,68.46 184.74,69.88 184.74,74.41 177.31,81.84 177.31,107.62 168.39,116.54 160.26,116.54 157.67,119.13 157.67,128.64 149.46,136.85 127.02,136.85 v126.93,136.76
MOTOR_A_A_2  (via drill 0.5)
  Top 0.508: CONTROL_BOARD.8 111.37,136.81 112.71,138.15 112.71,146 108.09,150.62 86.22,150.62 80.94,145.34 59.99,145.34 53.21,138.56 53.21,129.59 50.93,127.31 33.18,127.31 31.31,125.44 v31.31,124.86
  Bottom 0.508: v31.31,124.86 31.31,120.84 JP2.2
MOTOR_A_B_1  (via drill 0.5)
  Top 0.508: v123.48,138.76 122.81,139.43 122.81,141.31 120.62,143.5 117.76,143.5 116.45,142.19 CONTROL_BOARD.3
  Bottom 0.508: JP5.7 185.86,68.56 187.21,69.91 187.21,74.59 187.18,74.59 178.95,82.82 178.95,108.89 169.45,118.39 160.8,118.39 159.57,119.62 159.57,129.54 150.35,138.76 v123.48,138.76
MOTOR_A_B_2  (via drill 0.5)
  Top 0.508: CONTROL_BOARD.10 108.83,136.99 110.1,138.26 110.1,145.45 106.88,148.67 86.95,148.67 81.76,143.48 60.88,143.48 55.12,137.72 55.12,128.73 51.84,125.45 v40.8,125.45
  Bottom 0.508: v40.8,125.45 36.94,125.45 36.57,125.82 30.53,125.82 28.57,123.86 JP2.4
MOTOR_A_PWM_1  (via drill 0.5)
  Top 0.508: v121.43,141.05 119.32,141.05 CONTROL_BOARD.1
  Bottom 0.508: JP5.5 189.71,68.61 189.71,74.5 180.49,83.72 180.49,111.87 151.39,140.97 121.51,140.97 v121.43,141.05
MOTOR_A_PWM_2  (via drill 0.5)
  Top 0.508: CONTROL_BOARD.12 107.54,136.89 107.54,144.33 105.07,146.8 87.49,146.8 82.54,141.85 61.61,141.85 56.76,137 56.76,127.83 52.75,123.82 42.4,123.82 v42.4,123.78
  Bottom 0.508: v42.4,123.78 42.99,124.37 42.99,126.25 42.35,126.89 28.36,126.89 26.03,124.56 JP2.6
MOTOR_B_A_1  (via drill 0.5)
  Top 0.508: v123.33,133.02 122.06,131.75 116.81,131.75 113.91,134.65 CONTROL_BOARD.6
  Bottom 0.508: JP5.10 183.32,74.53 176.42,81.43 176.42,107.04 167.85,115.61 159.96,115.61 156.77,118.8 156.77,128.01 149.12,135.66 126.14,135.66 123.5,133.02 v123.33,133.02
MOTOR_B_A_2  (via drill 0.5)
  Top 0.508: CONTROL_BOARD.7 111.37,145.76 107.52,149.61 86.5,149.61 81.25,144.36 60.41,144.36 54.18,138.13 54.18,129.2 51.41,126.43 40.22,126.43 38.11,124.32 38.11,117.76 35.91,115.56 v34.15,115.56
  Bottom 0.508: v34.15,115.56 JP2.1
MOTOR_B_B_1  (via drill 0.5)
  Top 0.508: v121.91,134.4 120.22,132.71 117.78,132.71 116.45,134.04 CONTROL_BOARD.4
  Bottom 0.508: JP5.8 185.86,74.66 178.17,82.35 178.17,108.29 169.03,117.43 160.52,117.43 158.78,119.17 158.78,128.88 149.85,137.81 125.29,137.81 121.91,134.43 v121.91,134.4
MOTOR_B_B_2  (via drill 0.5)
  Top 0.508: CONTROL_BOARD.9 108.83,144.84 105.96,147.71 87.21,147.71 82.13,142.63 61.21,142.63 55.95,137.37 55.95,128.29 52.34,124.68 41.96,124.68 39.22,121.94 39.22,117.14 34.87,112.79 v29.85,112.79
  Bottom 0.508: v29.85,112.79 28.57,114.07 JP2.3
MOTOR_B_PWM_1  (via drill 0.5)
  Top 0.508: v121.35,136.8 120.19,135.64 CONTROL_BOARD.2
  Bottom 0.508: JP5.6 188.4,74.59 179.7,83.29 179.7,111 150.88,139.82 122.59,139.82 121.35,138.58 v121.35,136.8
MOTOR_B_PWM_2  (via drill 0.5)
  Top 0.508: CONTROL_BOARD.11 106.29,143.71 104.18,145.82 87.77,145.82 82.93,140.98 62,140.98 57.71,136.69 57.71,127.43 53.26,122.98 43.3,122.98 40.24,119.92 40.24,116.34 35.36,111.46 27.09,111.46 v26.18,112.37
  Bottom 0.508: v26.18,112.37 26.03,112.52 JP2.5
N$1
  Top 2.54: BATERY_1.3 42.7,133.94 42.86,134.1 42.86,138.31 62.4,157.85 BATERY_2.5
N$2
  Top 2.54: BATERY_2.3 151.78,157.85 171.73,137.9 BATERY_3.5
N$3
  Top 1.27: 83.28,189.39 83.3,189.38 83.05,189.13 D2.K 83.05,175.92 TL2.1 91.81,167.16 127.05,167.16 128.1,168.21 128.1,171.67 129.17,172.74 IO2.2
N$4
  Top 2.54: MAIN_POWER.2 61,101.38 69.01,109.39 76,109.39 86.49,119.88 FUSE.1
N$5
  Top 0.508: C13.2 102.19,86.76 Y2.2 97.12,85.24 97.12,80.77 97.79,80.1 104.68,80.1 105.33,80.76 105.67,81.1 105.74,81.1 106.35,81.7 106.35,82.13 105.9,82.58 U2.7
N$6
  Top 0.508: 150.06,77.99 149.53,77.99 D1.K
  Top 1.27: 149.53,77.99 146.46,74.92 146.46,72.71 143.7,69.95 138.35,69.95 136.51,68.12 TL1.1 | D1.K 151.87,80.41 IO1.2
N$7
  Bottom 0.508: C2.2 195.57,107.73 Y1.2 190.84,106.3 190.84,101.43 191.44,100.83 195.56,100.83 198.73,97.66 198.73,96.31 199.27,95.76 U1.7
N$8
  Bottom 0.508: Y1.1 C1.2 199.74,98.74 199.74,97.43 200.41,96.75 200.41,96.65 U1.8
N$9
  Top 0.508: Y2.1 102.13,81.68 C12.2 104.61,81.46 U2.8
N$11
  Top 1.27: C7.PLUS 133.97,83.29 TL1.2 134.45,83.78 134.45,92.12 133.49,93.08 133.49,95.69 | IO1.4 155.28,81.1 C5.2 161.51,82.5 161.51,98.97 159.85,100.63 138.43,100.63 133.49,95.69 | 133.49,95.69 128.14,95.69 FUSE1.1
N$12  (via drill 0.5)
  Top 0.508: LINE_SISTEM.1 120.01,90.36 v120.01,86.83 | v110.71,74.1 109.53,75.28 C14.2
  Bottom 0.508: v120.01,86.83 120.01,83.56 117.38,80.93 117.38,78.24 115.05,75.92 114.58,76.38 112.69,76.38 111.47,75.16 111.47,74.86 v110.71,74.1
N$13  (via drill 0.5)
  Top 0.508: C14.1 103.72,75.28 R2.1 103.71,73.94 RESET_LINE_SISTEM.1 | C14.1 106.29,73.08 RESET_LINE_SISTEM.2 | U2.29 v108.83,87.6 v108.83,87.59 | v106.38,77.71 106.38,75.36 C14.1
  Bottom 0.508: v106.38,77.71 106.64,77.97 113.79,77.97 115.11,79.29 115.11,81.34 113.89,82.55 112.77,82.55 112.68,82.64 112.68,83.53 111.12,85.09 111.12,86.6 110.13,87.59 v108.83,87.59
N$14  (via drill 0.5)
  Top 1.27: IO1.1 149.72,82.55 C4.2 146.42,83.93 C6.PLUS 144.68,88.94 v144.5,89.12 | C10.PLUS 143.43,188.06 143.43,176.13 141.25,173.96 141.25,170.85 139.99,169.59 | 139.99,169.59 135,169.59 134.74,169.85 C8.2 133.93,171.04 IO2.1 | 139.99,169.59 138.34,167.94 138.34,164.51 135.34,161.51 135.34,116.98 v126.92,108.56
  Top 2.54: MOTOR.2 61.14,84.42 61.14,81.07 63.22,78.99 73.03,78.99 87.07,93.02 FUSE.2
  Bottom 1.27: v144.5,89.12 139.79,93.83 139.79,95.69 v126.92,108.56 125.22,110.26 112.35,110.26 108.13,106.05 99.46,97.37 FUSE.2
N$15
  Top 2.54: MOTOR.1 47.77,84.5 FUSE3.2
N$16  (via drill 0.5)
  Top 0.508: v198.09,91.36 195.42,94.03 191.91,94.03 187.5,98.44 ULTRA_SISTEM.3
  Bottom 0.508: U1.30 | U1.30 203.6,87.9 201.86,86.16 200.96,86.16 198.09,89.04 v198.09,91.36
N$17  (via drill 0.5)
  Top 0.508: ULTRA_SISTEM.2 187.3,95.9 191.7,91.5 196.32,91.5 200.51,87.31 v201.29,87.31
  Bottom 0.508: U1.31 202.8,88.78 202.44,88.43 202.41,88.43 v201.29,87.31
N$18
  Top 0.508: C3.2 182.31,79.45 182.31,89.19 ULTRA_SISTEM.1
N$19
  Top 0.508: ULTRA_RESET.2 187,76.72 C3.1 | ULTRA_RESET.2 184.74,80.09 R8.1 | ULTRA_RESET.2 ULTRA_RESET.1
  Bottom 0.508: ULTRA_RESET.1 201.32,80.09 204.4,83.17 U1.29
N$20
  Top 0.508: R5.1 211.69,94.9 LED1.A
N$21
  Top 1.27: C11.PLUS 132.47,186.24 C9.2 | TL2.2 99.9,179.06 112.37,179.06 117.24,183.93 | C9.2 125.99,185.1 118.41,185.1 117.24,183.93 | C9.2 130.96,180.14 132.74,180.14 134.07,178.8 134.07,176.7 133.52,176.15 IO2.4 | 117.24,183.93 105.71,195.46 79.38,195.46 72.56,188.65 72.56,178.87 87.07,164.36 130.58,164.36 133.1,161.84 133.1,126.18 FUSE2.1
N$22
  Top 0.508: ARDUINO_LED.A 132.39,88.56 R3.1
N$23
  Top 0.508: R4.1 RPI_LED.A
R_5V
  Top 0.508: R4.2 71.89,131.76
  Top 1.27: FUSE2.2 98.35,113.97 98.35,119.99 94.36,123.99 74.27,123.99 POWER_CONTROL_BOARD.2 POWER_CONTROL_BOARD.4 POWER_CONTROL_BOARD.6 71.89,131.76
RAW_BATERY+
  Bottom 2.54: BATERY_1.5 42.7,82.18 MAIN_POWER.1
RESET_KICK
  Bottom 0.508: KICKER.1 117.75,170.96 122.5,170.96 131.88,161.58 131.88,146.91 129.8,144.83 125.59,144.83 JP8.9
RESET_SMALL_LINE
  Bottom 0.508: SMALL_LINE.1 158.38,57.27 132.44,31.33 JP6.6
RX_KICK
  Bottom 0.508: JP8.7 129.03,147.43 130.78,149.18 130.78,160.35 121.19,169.94 110.45,169.94 108.13,172.27 KICKER.3
RX_LINE_SISTEM
  Top 0.508: U2.30 108.03,90.22 110.98,93.17 LINE_SISTEM.3
RX_SMALL_LINE
  Bottom 0.508: SMALL_LINE.3 158.38,62.35 129.9,33.87 JP6.8
SCK  (via drill 0.5)
  Top 0.508: R5.2 210.96,96.74 v209.91,97.79 206.01,93.88 v206.01,86.54 | v111.26,82.31 111.79,81.78 U2.17 114.34,81.78 115.18,80.94 v115.18,74.85 | v200.83,73.57 191.66,64.4 185.89,64.4 148.18,26.69 140.74,26.69 136.2,22.15 v136.2,15.85 127,15.85 126.1,16.75 126.1,19.75 122.91,22.94 v121.91,22.94 | v83.12,156.89 115.26,156.89 v117.09,155.06
  Bottom 0.508: v209.91,97.79 209.09,96.96 U1.17 | JP5.4 190.94,75.9 193.39,78.35 202.65,78.35 | 202.65,78.35 206.01,81.71 v206.01,86.54 | JP2.7 23.61,115.44 23.61,112.13 24.51,111.23 53.63,111.23 55.49,113.1 | 55.49,113.1 56.81,113.1 61.76,113.1 74.96,99.9 74.96,92.13 84.86,82.23 84.86,67.03 87.3,64.59 94.12,64.59 95.46,65.93 95.46,72.92 104.85,82.31 105.06,82.31 105.51,82.76 110.81,82.76 v111.26,82.31 | 202.65,78.35 202.65,75.39 v200.83,73.57 | v136.2,15.85 134.98,17.07 JP6.3 | v115.18,74.85 114.31,75.72 112.97,75.72 112.13,74.88 112.13,73.95 117.17,68.91 117.17,27.76 121.94,22.98 v121.91,22.94 | 55.49,113.1 63.97,121.57 63.97,129.27 71.68,136.98 76.21,136.98 83.12,143.89 v83.12,156.89 | v117.09,155.06 JP8.2
SCL  (via drill 0.5)
  Top 0.508: U2.28 109.75,88.99 109.75,89.68 109.77,89.7 109.77,90.28 110.13,90.63 v110.13,90.86 | CONTROL_BOARD.14 103.75,132.51 105.14,131.12 107.78,131.12 113.31,125.59 113.31,108.96 v113.27,108.92
  Bottom 0.508: v110.13,90.86 110.13,92.22 109.75,92.6 109.75,96.28 111.04,97.57 111.04,106.25 113.27,108.48 v113.27,108.92
SDA  (via drill 0.5)
  Top 0.508: v111.23,90.86 110.99,90.62 110.99,90.51 110.43,89.95 U2.27 | v114.71,108.85 v114.7,108.86 114.7,125.65 108.18,132.17 105.47,132.17 105.06,132.58 105.06,138.67 103.75,139.98 CONTROL_BOARD.13
  Bottom 0.508: v111.23,90.86 111.23,91.65 112.22,92.64 112.22,105.36 114.71,107.85 v114.71,108.85
SS_KICK  (via drill 0.5)
  Top 0.508: U2.11 108.03,82.22 108.57,82.76 109.34,82.76 v110.46,83.88 | v124.58,108.98 123.47,110.09 119.91,110.09 118.58,111.42 118.58,116.51 131.25,129.18 131.25,148.91 127.61,152.55 v115.27,152.55
  Bottom 0.508: v110.46,83.88 110.46,85.58 109.3,86.74 109.19,86.74 109.18,86.73 108.47,86.73 107.97,87.24 107.97,87.29 107.88,87.38 107.88,88.11 108.31,88.54 112.37,88.54 116.01,92.18 116.66,92.18 117.35,92.87 117.35,103.22 120.1,105.98 121.57,105.98 v124.58,108.98 | v115.27,152.55 120.41,152.55 JP8.4
SS_MOTOR_1  (via drill 0.5)
  Top 0.508: v195.95,73.5 197.27,72.18 197.27,71.41 196.27,70.41 178.24,70.41 176.48,68.65 176.48,57.59 172.9,54.01 169.58,54.01 168.28,55.3 162.74,55.3 161.55,54.11 135.81,54.11 v135.59,54.33 | v113.9,74.61 111.73,74.61 109.63,76.71 U2.13
  Bottom 0.508: JP5.2 194.6,73.5 v195.95,73.5 | v113.9,74.61 118.91,69.6 118.91,63.24 127.82,54.33 v135.59,54.33
SS_MOTOR_2  (via drill 0.5)
  Top 0.508: v108.93,81.9 108.93,81.39 108.81,81.27 108.81,80.32 U2.12
  Bottom 0.508: JP2.9 21.87,114.64 21.87,112.12 23.61,110.38 30.07,110.38 53.92,110.38 55.82,112.28 61.43,112.28 74.15,99.57 74.15,91.8 84.05,81.9 84.05,66.7 86.96,63.78 94.45,63.78 96.27,65.6 96.27,72.59 105.58,81.9 v108.93,81.9
SS_SMALL_LINE  (via drill 0.5)
  Top 0.508: U2.10 107.23,79.33 108.72,77.84 v108.72,77.09
  Bottom 0.508: v108.72,77.09 108.72,76.75 107.22,75.25 107.22,74.62 108.13,73.71 109.72,73.71 113,70.43 113,26.69 118.9,20.79 118.9,16.55 119.73,15.72 121.37,15.72 121.51,15.58 129.75,15.58 131.21,17.04 131.21,21.4 131.9,22.09 135.85,22.09 137.52,20.42 JP6.1
SS_ULTRA  (via drill 0.5)
  Top 0.508: v205.38,102.79 198.33,109.84 131.9,109.84 v127.71,105.65 | v110.91,76.91 110.43,77.39 U2.14
  Bottom 0.508: U1.14 206,102.17 v205.38,102.79 | v127.71,105.65 127.71,96.55 116.44,85.28 116.44,79.3 114.18,77.04 112.42,77.04 111.88,76.5 111.32,76.5 v110.91,76.91
TX_KICK  (via drill 0.5)
  Top 0.508: KICKER.2 110.67,172.46 v107.65,169.44
  Bottom 0.508: v107.65,169.44 107.65,151.86 101.48,145.69 101.48,144.58 102.4,143.66 106.44,143.66 110.21,147.43 JP8.8
TX_LINE_SISTEM
  Top 0.508: U2.31 107.23,90.36 109.71,92.83 109.71,95.97 110.2,96.46 112.85,96.46 113.52,95.79 LINE_SISTEM.2
TX_SMALL_LINE
  Bottom 0.508: JP6.7 129.9,21.33 131.12,22.55 131.12,32.55 158.38,59.81 SMALL_LINE.2
U1
  Bottom 0.508: ULTRA_1.3 ULTRA_1.2 21.33,96.88 21.69,96.88 22.54,97.73 22.54,99.88 21.53,100.89 17.04,100.89 15.65,102.28 15.65,120.26 23.47,128.08 30.97,128.08 89.5,186.61 119.12,186.61 135.69,170.04 137.78,170.04 182.32,125.5 192.15,125.5 192.94,124.71 194.77,124.71 202.27,117.22 202.27,99.69 202,99.42 U1.9
U2
  Top 1.27: ULTRA_2.3 ULTRA_2.2
  Bottom 0.508: ULTRA_2.2 108.32,183.56 110.54,185.77 118.92,185.77 135.31,169.38 137.51,169.38 182.05,124.84 191.88,124.84 192.67,124.05 194.5,124.05 201.61,116.94 201.61,99.96 201.06,99.41 201.06,97.5 201.75,96.8 202.36,96.8 202.8,97.24 U1.10
U3  (via drill 0.5)
  Top 0.508: v203.52,100.55 198.22,95.25 196.58,95.25 196.57,95.24 ULTRA_3.3
  Bottom 0.508: ULTRA_3.3 ULTRA_3.2 | U1.11 203.6,100.47 v203.52,100.55

### Text on the board
tNames: --> | B | C | - | + | --> | + | - | GND | - | + | Jakub Gal | 2020 | <-- | A | <-- | D